# Altium schematic sheet Input.SchDoc
size A
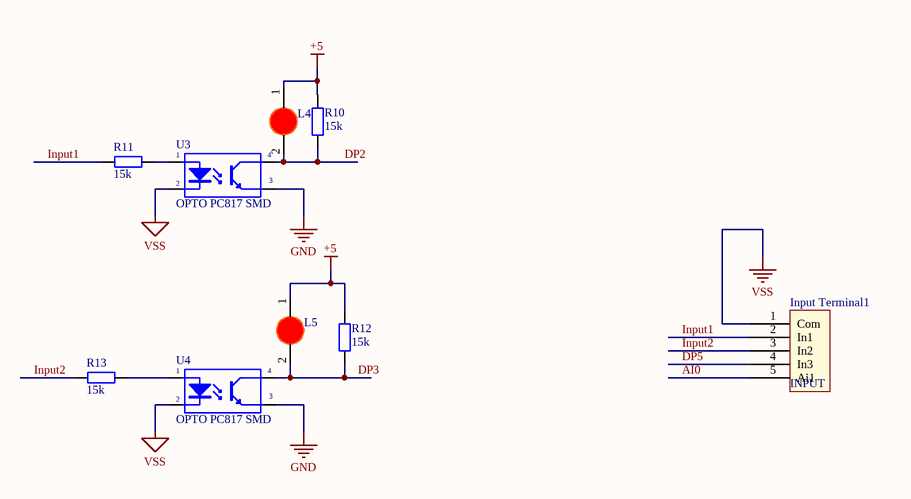
[diagram p0: Input.SchDoc]

## Parts
Input_Terminal1  INPUT  [KF5-5]
L4  LED 0805  [LED-1206-Red]  (value not drawn)
L5  LED 0805  [LED-1206-Red]  (value not drawn)
R10  15k  [tro smd 0805]
R11  15k  [tro smd 0805]
R12  15k  [tro smd 0805]
R13  15k  [tro smd 0805]
U3  OPTO PC817 SMD  [SOP4]
U4  OPTO PC817 SMD  [SOP4]

## Nets
+5: L4.1(A) L5.1(A) R10.2 R12.2
GND: U3.3(E) U4.3(E)
VSS: Input_Terminal1.1(Com) U3.2(K) U4.2(K)
AI0: Input_Terminal1.5(Ai1)
DP2: L4.2(K) R10.1 U3.4(C)
DP3: L5.2(K) R12.1 U4.4(C)
DP5: Input_Terminal1.4(In3)
Input1: Input_Terminal1.2(In1) R11.1
Input2: Input_Terminal1.3(In2) R13.1
NetR11_2: R11.2 U3.1(A)
NetR13_2: R13.2 U4.1(A)

## Library data of the parts
L4 L5 = LED 1206 Do: Dán; Don_Vi: Con; Ma_Hang: MH002334; Ten_Linh_Kien: LED1206 Màu Đỏ (Red); Ghi_Chu: *; Kieu_Chan: *; Chung_Loai: Dán
R10-R13 = Tro 0805 1% 15k: Dán; Don_Vi: Con; So_Chan: 2; Ten_Linh_Kien: Trở 0805 1% 15k; Ma_Hang: MH005476; Chung_Loai: Dán; Kieu_Chan: *
U3 U4 = OPTO PC817 SMD: Single Opto; Value: PC817